# EAGLE schematic OpenDeck-r2.1.0 (EAGLE 7.4.0)
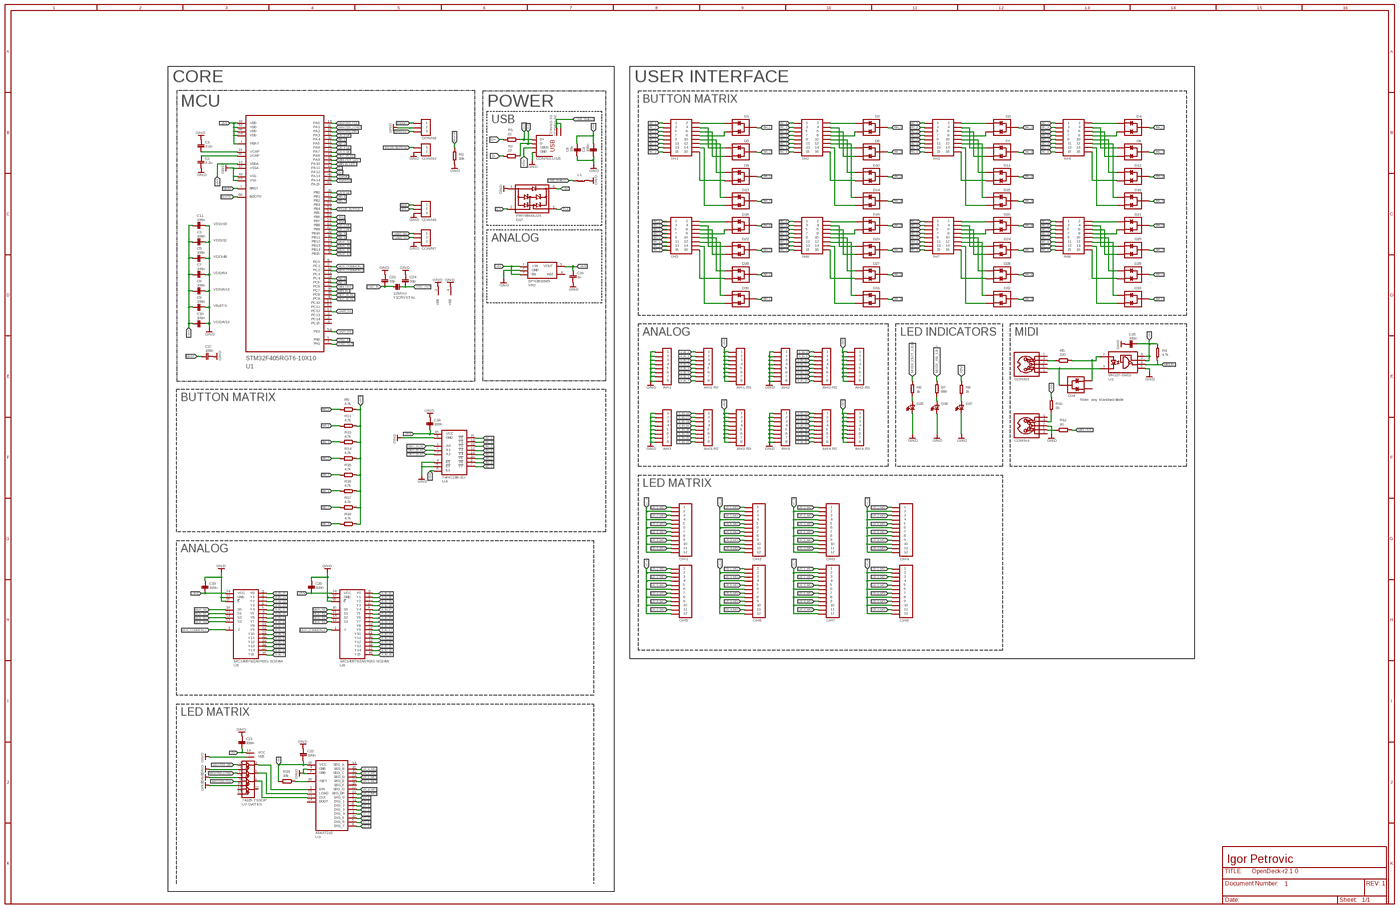
[diagram p0: schematic, sheet 1, overview]
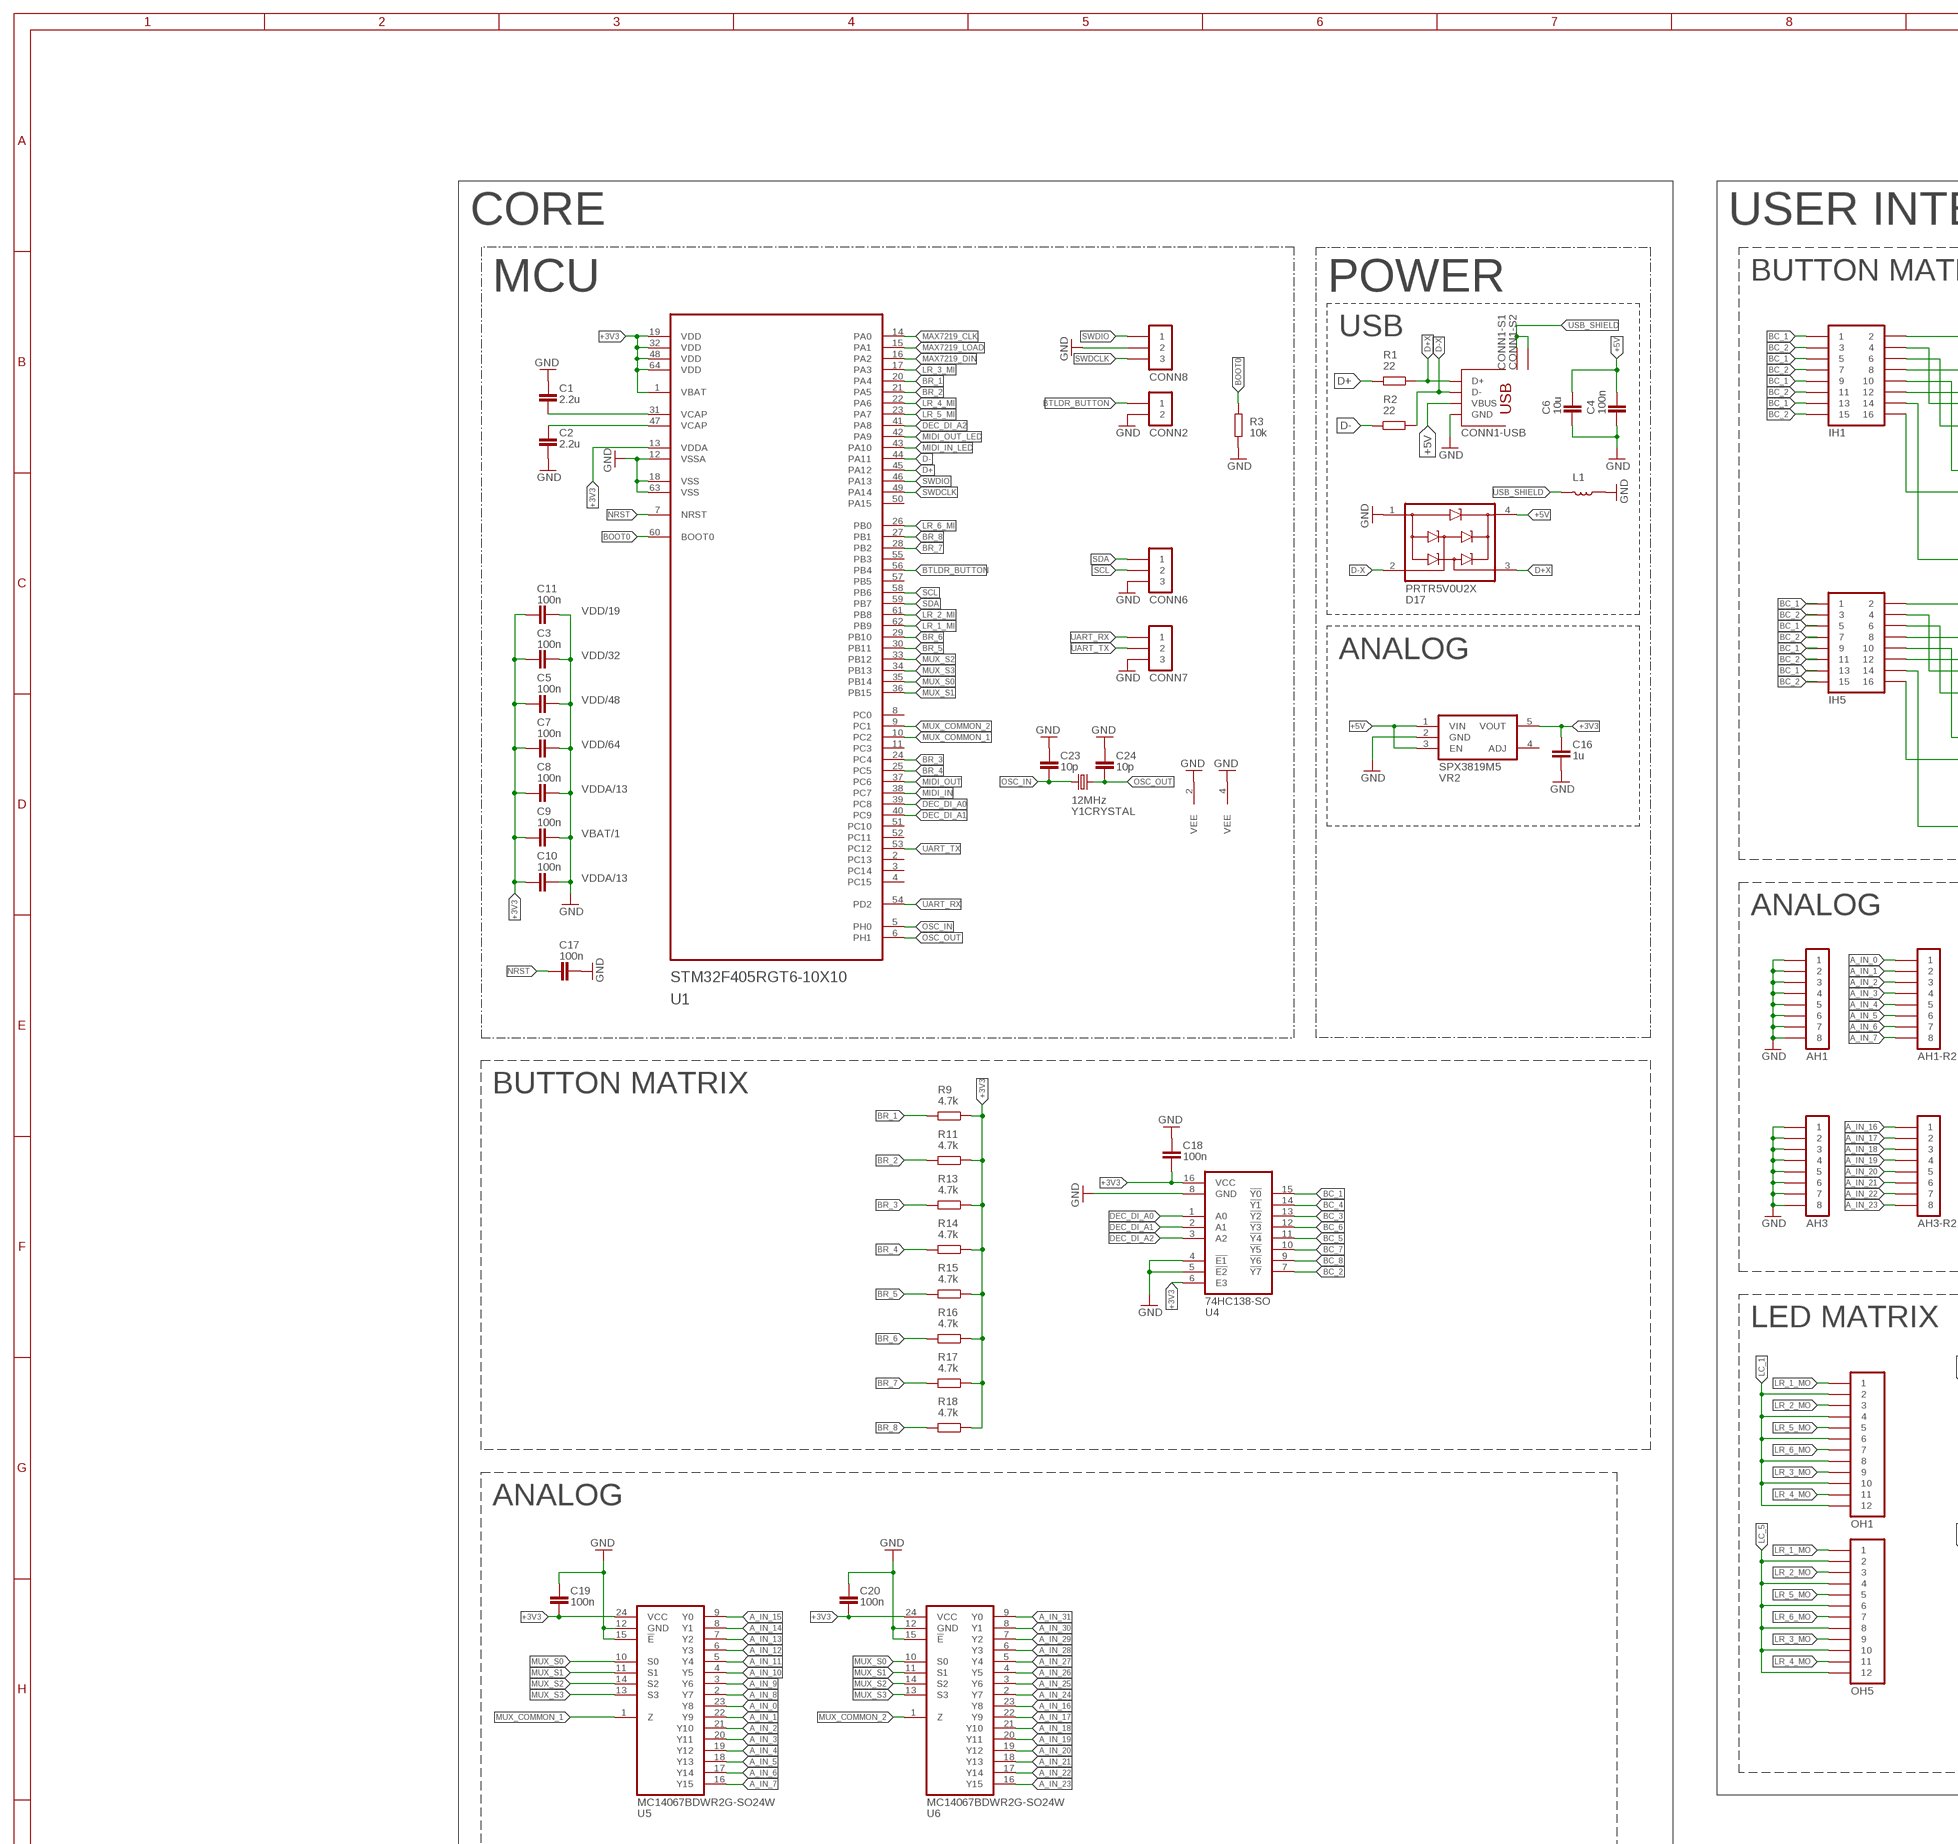
[diagram p1: schematic, sheet 1, part 1 of 4]
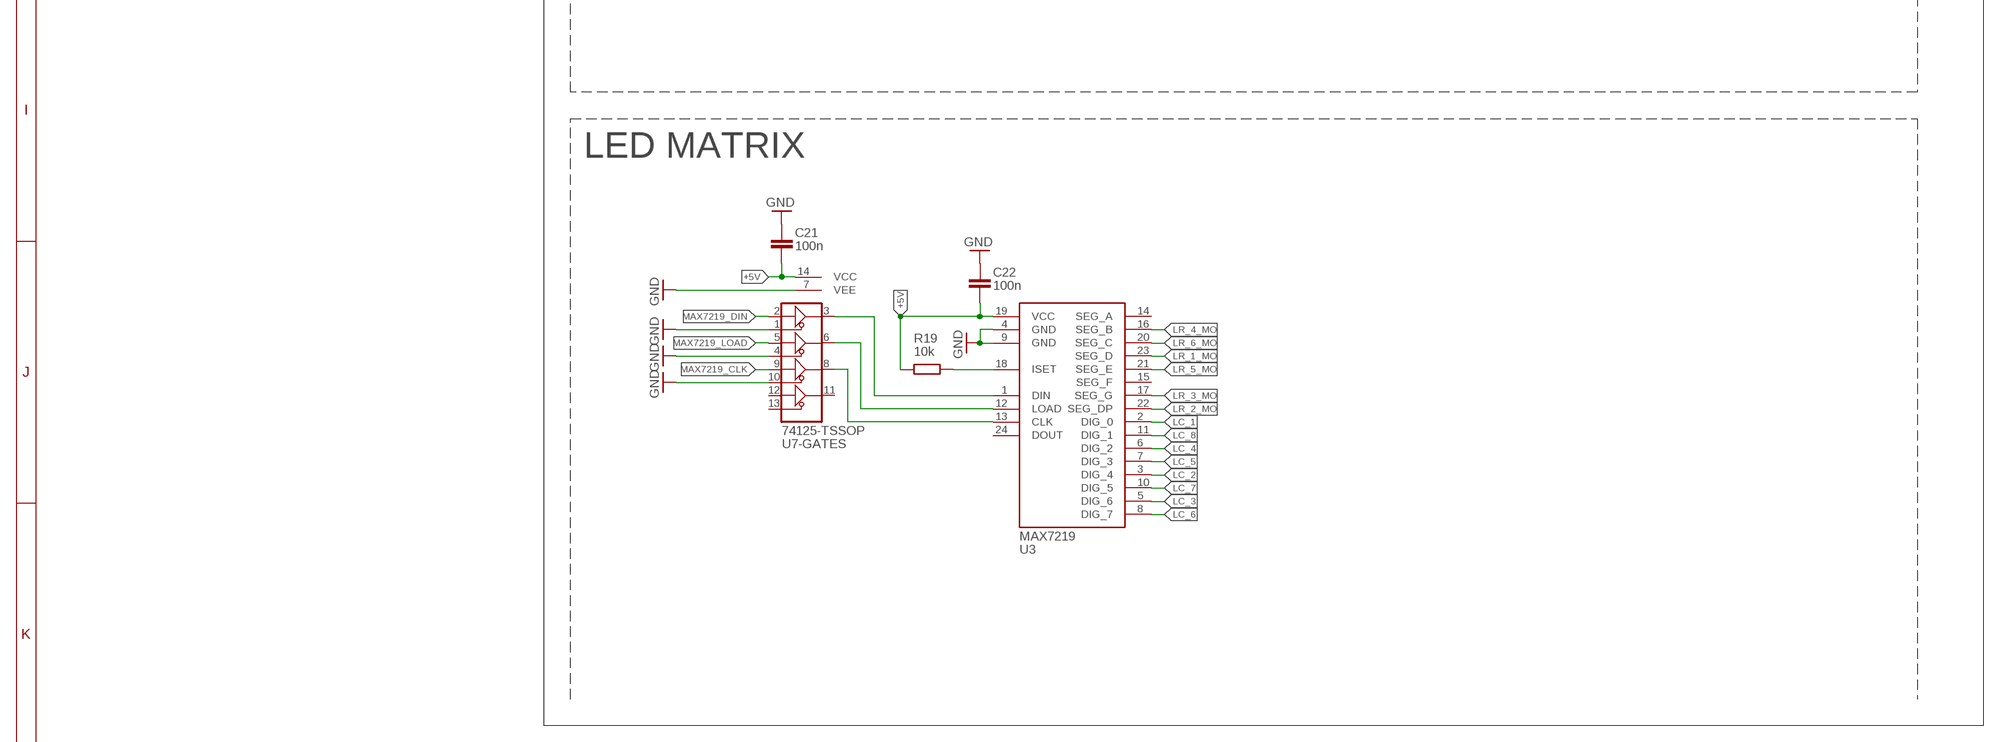
[diagram p2: schematic, sheet 1, part 2 of 4]
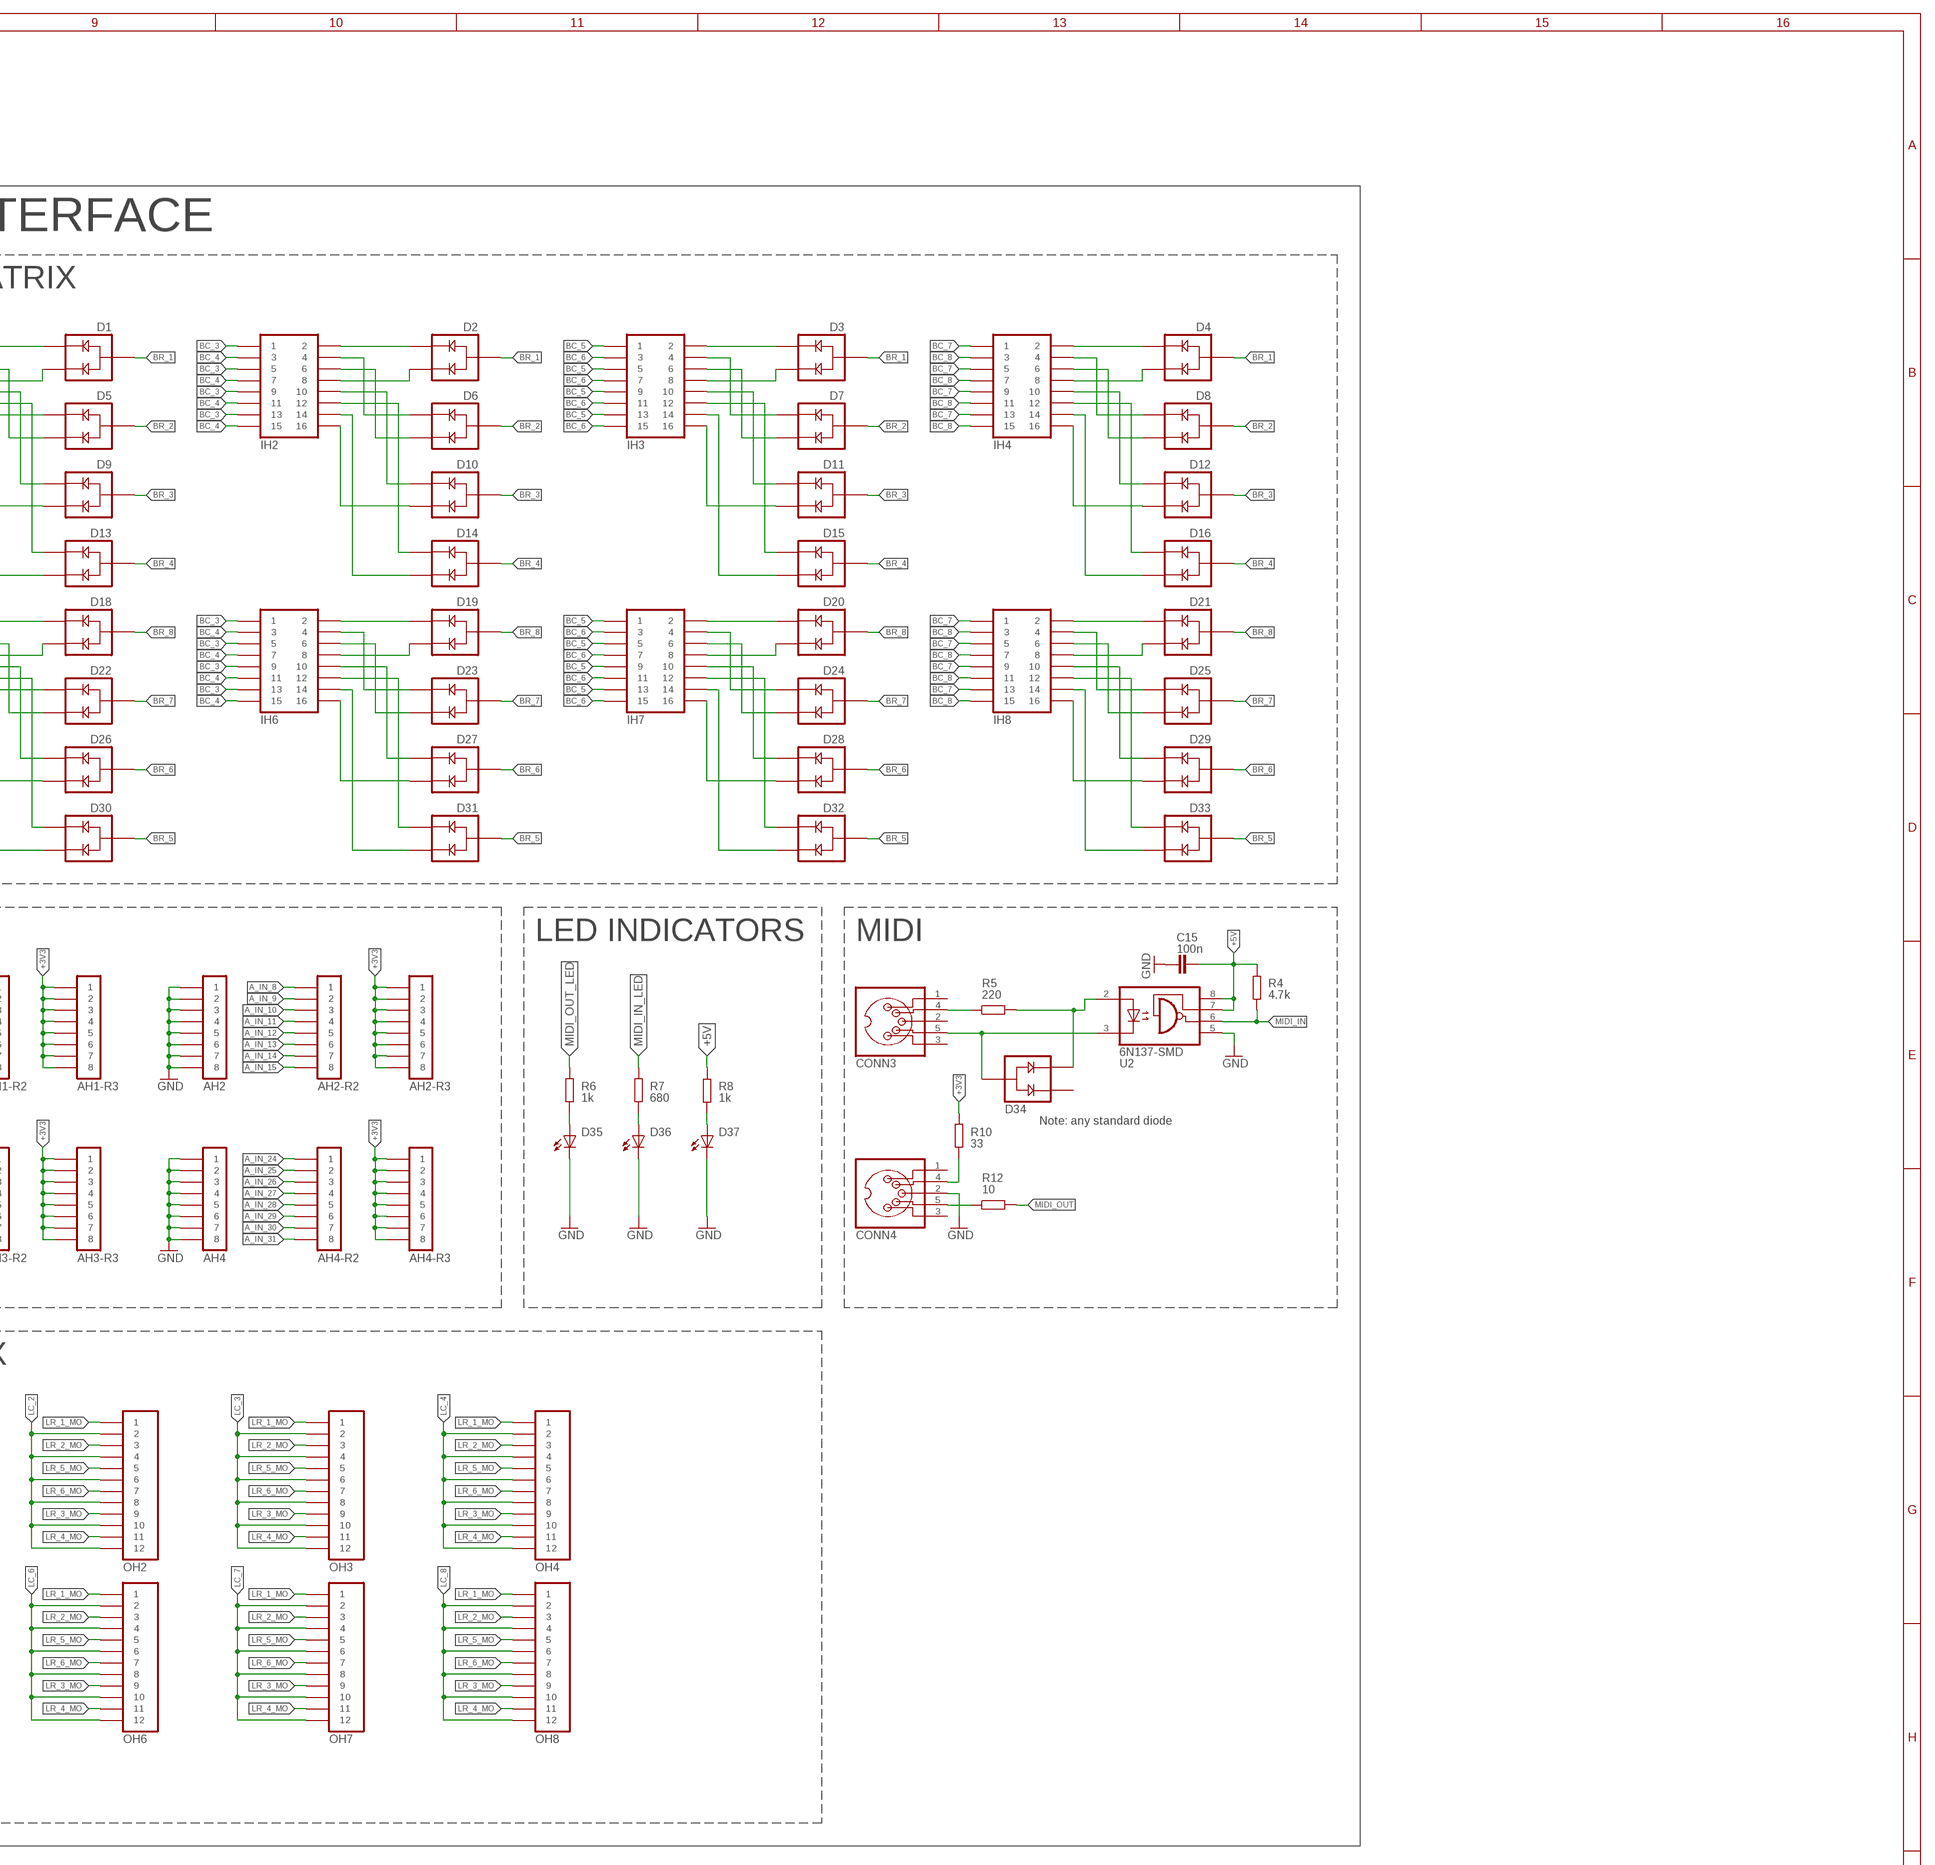
[diagram p3: schematic, sheet 1, part 3 of 4]
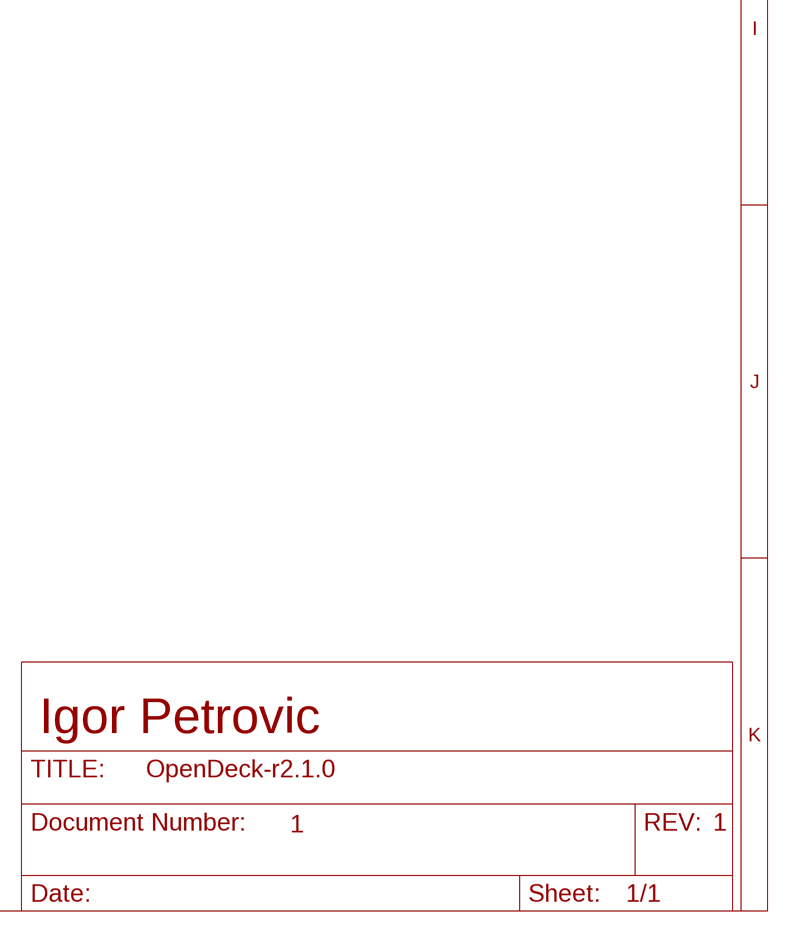
[diagram p4: schematic, sheet 1, part 4 of 4]

## Parts
AH1  PINHD-3X08  [3X08-2.54]
AH2  PINHD-3X08  [3X08-2.54]
AH3  PINHD-3X08  [3X08-2.54]
AH4  PINHD-3X08  [3X08-2.54]
C1  2.2u  CAPACITOR-0402  [C0402]
C2  2.2u  CAPACITOR-0402  [C0402]
C3  100n  CAPACITOR-0402  [C0402]
C4  100n  CAPACITOR-0402  [C0402]
C5  100n  CAPACITOR-0402  [C0402]
C6  10u  CAPACITOR-0402  [C0402]
C7  100n  CAPACITOR-0402  [C0402]
C8  100n  CAPACITOR-0402  [C0402]
C9  100n  CAPACITOR-0402  [C0402]
C10  100n  CAPACITOR-0402  [C0402]
C11  100n  CAPACITOR-0402  [C0402]
C15  100n  CAPACITOR-0402  [C0402]
C16  1u  CAPACITOR-0402  [C0402]
C17  100n  CAPACITOR-0402  [C0402]
C18  100n  CAPACITOR-0402  [C0402]
C19  100n  CAPACITOR-0402  [C0402]
C20  100n  CAPACITOR-0402  [C0402]
C21  100n  CAPACITOR-0402  [C0402]
C22  100n  CAPACITOR-0402  [C0402]
C23  10p  CAPACITOR-0402  [C0402]
C24  10p  CAPACITOR-0402  [C0402]
CONN1  USB-B-H  [USB-B-PTH]
CONN2  PINHD-1X02-TH-2.54MM  [1X02-2.54-V]
CONN3  MIDI_CONN-STD  [DIN5]
CONN4  MIDI_CONN-STD  [DIN5]
CONN6  PINHD-1X03-TH-2.54MM  [1X03-2.54-V]
CONN7  PINHD-1X03-TH-2.54MM  [1X03-2.54-V]
CONN8  PINHD-1X03-TH-2.54MM  [1X03-2.54-V]
D1  BAW56  [SOT23]
D2  BAW56  [SOT23]
D3  BAW56  [SOT23]
D4  BAW56  [SOT23]
D5  BAW56  [SOT23]
D6  BAW56  [SOT23]
D7  BAW56  [SOT23]
D8  BAW56  [SOT23]
D9  BAW56  [SOT23]
D10  BAW56  [SOT23]
D11  BAW56  [SOT23]
D12  BAW56  [SOT23]
D13  BAW56  [SOT23]
D14  BAW56  [SOT23]
D15  BAW56  [SOT23]
D16  BAW56  [SOT23]
D17  PRTR5V0U2X  [SOT143]
D18  BAW56  [SOT23]
D19  BAW56  [SOT23]
D20  BAW56  [SOT23]
D21  BAW56  [SOT23]
D22  BAW56  [SOT23]
D23  BAW56  [SOT23]
D24  BAW56  [SOT23]
D25  BAW56  [SOT23]
D26  BAW56  [SOT23]
D27  BAW56  [SOT23]
D28  BAW56  [SOT23]
D29  BAW56  [SOT23]
D30  BAW56  [SOT23]
D31  BAW56  [SOT23]
D32  BAW56  [SOT23]
D33  BAW56  [SOT23]
D34  BAW56  [SOT23]
D35  Red  LED-0805  [0805_LED]
D36  Yellow  LED-0805  [0805_LED]
D37  Green  LED-0805  [0805_LED]
IH1  PINHD-2X08-TH-2.54MM  [2X08-2.54]
IH2  PINHD-2X08-TH-2.54MM  [2X08-2.54]
IH3  PINHD-2X08-TH-2.54MM  [2X08-2.54]
IH4  PINHD-2X08-TH-2.54MM  [2X08-2.54]
IH5  PINHD-2X08-TH-2.54MM  [2X08-2.54]
IH6  PINHD-2X08-TH-2.54MM  [2X08-2.54]
IH7  PINHD-2X08-TH-2.54MM  [2X08-2.54]
IH8  PINHD-2X08-TH-2.54MM  [2X08-2.54]
L1  FERRITE_BEAD-BLM21PG221SN1D  [L0805]
OH1  PINHD-2X06-TH-2.54MM  [2X06-2.54-V]
OH2  PINHD-2X06-TH-2.54MM  [2X06-2.54-V]
OH3  PINHD-2X06-TH-2.54MM  [2X06-2.54-V]
OH4  PINHD-2X06-TH-2.54MM  [2X06-2.54-V]
OH5  PINHD-2X06-TH-2.54MM  [2X06-2.54-V]
OH6  PINHD-2X06-TH-2.54MM  [2X06-2.54-V]
OH7  PINHD-2X06-TH-2.54MM  [2X06-2.54-V]
OH8  PINHD-2X06-TH-2.54MM  [2X06-2.54-V]
R1  22  RESISTOR-0402  [R0402]
R2  22  RESISTOR-0402  [R0402]
R3  10k  RESISTOR-0402  [R0402]
R4  4.7k  RESISTOR-0402  [R0402]
R5  220  RESISTOR-0402  [R0402]
R6  1k  RESISTOR-0402  [R0402]
R7  680  RESISTOR-0402  [R0402]
R8  1k  RESISTOR-0402  [R0402]
R9  4.7k  RESISTOR-0402  [R0402]
R10  33  RESISTOR-0402  [R0402]
R11  4.7k  RESISTOR-0402  [R0402]
R12  10  RESISTOR-0402  [R0402]
R13  4.7k  RESISTOR-0402  [R0402]
R14  4.7k  RESISTOR-0402  [R0402]
R15  4.7k  RESISTOR-0402  [R0402]
R16  4.7k  RESISTOR-0402  [R0402]
R17  4.7k  RESISTOR-0402  [R0402]
R18  4.7k  RESISTOR-0402  [R0402]
R19  10k  RESISTOR-0402  [R0402]
U1  STM32F405RGT6-10X10  [TQFP-64-10X10]
U2  6N137-SMD  [SMD-8]
U3  MAX7219  [SO24-W]
U4  74HC138-SO  [SO16]
U5  MC14067BDWR2G-SO24W  [SO24-W]
U6  MC14067BDWR2G-SO24W  [SO24-W]
U7  74125-TSSOP  [TSSOP14]
VR2  SPX3819M5  [SOT23-5]
Y1  12MHz  CRYSTAL-4P-SMD-2.5X2  [CRYSTAL-SMD-2.5X2]

## Nets
+3V3: AH1.3 AH1.6 AH1.9 AH1.12 AH1.15 AH1.18 AH1.21 AH1.24 AH2.3 AH2.6 AH2.9 AH2.12 AH2.15 AH2.18 AH2.21 AH2.24 AH3.3 AH3.6 AH3.9 AH3.12 AH3.15 AH3.18 AH3.21 AH3.24 AH4.3 AH4.6 AH4.9 AH4.12 AH4.15 AH4.18 AH4.21 AH4.24 C3.1 C5.1 C7.1 C8.1 C9.1 C10.1 C11.1 C16.1 C18.2 C19.2 C20.2 R9.1 R10.2 R11.1 R13.1 R14.1 R15.1 R16.1 R17.1 R18.1 U1.1(VBAT) U1.13(VDDA) U1.19(VDD) U1.32(VDD) U1.48(VDD) U1.64(VDD) U4.6(E3) U4.16(VCC) U5.24(VCC) U6.24(VCC) VR2.5(VOUT)
+5V [vcc]: C4.2 C6.2 C15.2 C21.1 C22.1 CONN1.VBUS(-USB:VBUS) D17.4(VCC) R4.1 R8.1 R19.2 U2.7(VE) U2.8(VCC) U3.19(VCC) U7.14(-VCC:VCC) VR2.1(VIN) VR2.3(EN)
A_IN_0: AH1.2 U5.23(Y8)
A_IN_1: AH1.5 U5.22(Y9)
A_IN_2: AH1.8 U5.21(Y10)
A_IN_3: AH1.11 U5.20(Y11)
A_IN_4: AH1.14 U5.19(Y12)
A_IN_5: AH1.17 U5.18(Y13)
A_IN_6: AH1.20 U5.17(Y14)
A_IN_7: AH1.23 U5.16(Y15)
A_IN_8: AH2.2 U5.2(Y7)
A_IN_9: AH2.5 U5.3(Y6)
A_IN_10: AH2.8 U5.4(Y5)
A_IN_11: AH2.11 U5.5(Y4)
A_IN_12: AH2.14 U5.6(Y3)
A_IN_13: AH2.17 U5.7(Y2)
A_IN_14: AH2.20 U5.8(Y1)
A_IN_15: AH2.23 U5.9(Y0)
A_IN_16: AH3.2 U6.23(Y8)
A_IN_17: AH3.5 U6.22(Y9)
A_IN_18: AH3.8 U6.21(Y10)
A_IN_19: AH3.11 U6.20(Y11)
A_IN_20: AH3.14 U6.19(Y12)
A_IN_21: AH3.17 U6.18(Y13)
A_IN_22: AH3.20 U6.17(Y14)
A_IN_23: AH3.23 U6.16(Y15)
A_IN_24: AH4.2 U6.2(Y7)
A_IN_25: AH4.5 U6.3(Y6)
A_IN_26: AH4.8 U6.4(Y5)
A_IN_27: AH4.11 U6.5(Y4)
A_IN_28: AH4.14 U6.6(Y3)
A_IN_29: AH4.17 U6.7(Y2)
A_IN_30: AH4.20 U6.8(Y1)
A_IN_31: AH4.23 U6.9(Y0)
BC_1: IH1.1 IH1.5 IH1.9 IH1.13 IH5.1 IH5.5 IH5.9 IH5.13 U4.15(!Y0)
BC_2: IH1.3 IH1.7 IH1.11 IH1.15 IH5.3 IH5.7 IH5.11 IH5.15 U4.7(!Y7)
BC_3: IH2.1 IH2.5 IH2.9 IH2.13 IH6.1 IH6.5 IH6.9 IH6.13 U4.13(!Y2)
BC_4: IH2.3 IH2.7 IH2.11 IH2.15 IH6.3 IH6.7 IH6.11 IH6.15 U4.14(!Y1)
BC_5: IH3.1 IH3.5 IH3.9 IH3.13 IH7.1 IH7.5 IH7.9 IH7.13 U4.11(!Y4)
BC_6: IH3.3 IH3.7 IH3.11 IH3.15 IH7.3 IH7.7 IH7.11 IH7.15 U4.12(!Y3)
BC_7: IH4.1 IH4.5 IH4.9 IH4.13 IH8.1 IH8.5 IH8.9 IH8.13 U4.10(!Y5)
BC_8: IH4.3 IH4.7 IH4.11 IH4.15 IH8.3 IH8.7 IH8.11 IH8.15 U4.9(!Y6)
BOOT0: R3.2 U1.60(BOOT0)
BR_1: D1.3 D2.3 D3.3 D4.3 R9.2 U1.20(PA4)
BR_2: D5.3 D6.3 D7.3 D8.3 R11.2 U1.21(PA5)
BR_3: D9.3 D10.3 D11.3 D12.3 R13.2 U1.24(PC4)
BR_4: D13.3 D14.3 D15.3 D16.3 R14.2 U1.25(PC5)
BR_5: D30.3 D31.3 D32.3 D33.3 R15.2 U1.30(PB11)
BR_6: D26.3 D27.3 D28.3 D29.3 R16.2 U1.29(PB10)
BR_7: D22.3 D23.3 D24.3 D25.3 R17.2 U1.28(PB2)
BR_8: D18.3 D19.3 D20.3 D21.3 R18.2 U1.27(PB1)
BTLDR_BUTTON: CONN2.1 U1.56(PB4)
D+: R1.2 U1.45(PA12)
D+X: CONN1.D+(-USB:D+) D17.3(I/O2) R1.1
D-: R2.1 U1.44(PA11)
D-X: CONN1.D-(-USB:D-) D17.2(I/O1) R2.2
DEC_DI_A0: U1.39(PC8) U4.1(A0)
DEC_DI_A1: U1.40(PC9) U4.2(A1)
DEC_DI_A2: U1.41(PA8) U4.3(A2)
GND: AH1.1 AH1.4 AH1.7 AH1.10 AH1.13 AH1.16 AH1.19 AH1.22 AH2.1 AH2.4 AH2.7 AH2.10 AH2.13 AH2.16 AH2.19 AH2.22 AH3.1 AH3.4 AH3.7 AH3.10 AH3.13 AH3.16 AH3.19 AH3.22 AH4.1 AH4.4 AH4.7 AH4.10 AH4.13 AH4.16 AH4.19 AH4.22 C1.1 C2.2 C3.2 C4.1 C5.2 C6.1 C7.2 C8.2 C9.2 C10.2 C11.2 C15.1 C16.2 C17.2 C18.1 C19.1 C20.1 C21.2 C22.2 C23.2 C24.2 CONN1.GND(-USB:GND) CONN2.2 CONN4.2 CONN6.3 CONN7.3 CONN8.2 D17.1(GND) D35.C D36.C D37.C L1.1 R3.1 U1.12(VSSA) U1.18(VSS) U1.63(VSS) U2.5(GND) U3.4(GND) U3.9(GND) U4.4(!E1) U4.5(!E2) U4.8(GND) U5.12(GND) U5.15(!E) U6.12(GND) U6.15(!E) U7.1(-GATES:1!(OE)) U7.4(-GATES:2!(OE)) U7.7(-GND:VEE) U7.10(-GATES:3!(OE)) VR2.2(GND) Y1.2(GND1:VEE) Y1.4(GND2:VEE)
IH1_2: D1.1 IH1.2
IH1_4: D5.1 IH1.4
IH1_6: D5.2 IH1.6
IH1_8: D1.2 IH1.8
IH1_10: D9.1 IH1.10
IH1_12: D13.1 IH1.12
IH1_14: D13.2 IH1.14
IH1_16: D9.2 IH1.16
IH2_2: D2.1 IH2.2
IH2_4: D6.1 IH2.4
IH2_6: D6.2 IH2.6
IH2_8: D2.2 IH2.8
IH2_10: D10.1 IH2.10
IH2_12: D14.1 IH2.12
IH2_14: D14.2 IH2.14
IH2_16: D10.2 IH2.16
IH3_2: D3.1 IH3.2
IH3_4: D7.1 IH3.4
IH3_6: D7.2 IH3.6
IH3_8: D3.2 IH3.8
IH3_10: D11.1 IH3.10
IH3_12: D15.1 IH3.12
IH3_14: D15.2 IH3.14
IH3_16: D11.2 IH3.16
IH4_2: D4.1 IH4.2
IH4_4: D8.1 IH4.4
IH4_6: D8.2 IH4.6
IH4_8: D4.2 IH4.8
IH4_10: D12.1 IH4.10
IH4_12: D16.1 IH4.12
IH4_14: D16.2 IH4.14
IH4_16: D12.2 IH4.16
IH5_2: D18.1 IH5.2
IH5_4: D22.1 IH5.4
IH5_6: D22.2 IH5.6
IH5_8: D18.2 IH5.8
IH5_10: D26.1 IH5.10
IH5_12: D30.1 IH5.12
IH5_14: D30.2 IH5.14
IH5_16: D26.2 IH5.16
IH6_2: D19.1 IH6.2
IH6_4: D23.1 IH6.4
IH6_6: D23.2 IH6.6
IH6_8: D19.2 IH6.8
IH6_10: D27.1 IH6.10
IH6_12: D31.1 IH6.12
IH6_14: D31.2 IH6.14
IH6_16: D27.2 IH6.16
IH7_2: D20.1 IH7.2
IH7_4: D24.1 IH7.4
IH7_6: D24.2 IH7.6
IH7_8: D20.2 IH7.8
IH7_10: D28.1 IH7.10
IH7_12: D32.1 IH7.12
IH7_14: D32.2 IH7.14
IH7_16: D28.2 IH7.16
IH8_2: D21.1 IH8.2
IH8_4: D25.1 IH8.4
IH8_6: D25.2 IH8.6
IH8_8: D21.2 IH8.8
IH8_10: D29.1 IH8.10
IH8_12: D33.1 IH8.12
IH8_14: D33.2 IH8.14
IH8_16: D29.2 IH8.16
LC_1: OH1.2 OH1.4 OH1.6 OH1.8 OH1.10 OH1.12 U3.2(DIG_0)
LC_2: OH2.2 OH2.4 OH2.6 OH2.8 OH2.10 OH2.12 U3.3(DIG_4)
LC_3: OH3.2 OH3.4 OH3.6 OH3.8 OH3.10 OH3.12 U3.5(DIG_6)
LC_4: OH4.2 OH4.4 OH4.6 OH4.8 OH4.10 OH4.12 U3.6(DIG_2)
LC_5: OH5.2 OH5.4 OH5.6 OH5.8 OH5.10 OH5.12 U3.7(DIG_3)
LC_6: OH6.2 OH6.4 OH6.6 OH6.8 OH6.10 OH6.12 U3.8(DIG_7)
LC_7: OH7.2 OH7.4 OH7.6 OH7.8 OH7.10 OH7.12 U3.10(DIG_5)
LC_8: OH8.2 OH8.4 OH8.6 OH8.8 OH8.10 OH8.12 U3.11(DIG_1)
LR_1_MI: U1.62(PB9)
LR_1_MO: OH1.1 OH2.1 OH3.1 OH4.1 OH5.1 OH6.1 OH7.1 OH8.1 U3.23(SEG_D)
LR_2_MI: U1.61(PB8)
LR_2_MO: OH1.3 OH2.3 OH3.3 OH4.3 OH5.3 OH6.3 OH7.3 OH8.3 U3.22(SEG_DP)
LR_3_MI: U1.17(PA3)
LR_3_MO: OH1.9 OH2.9 OH3.9 OH4.9 OH5.9 OH6.9 OH7.9 OH8.9 U3.17(SEG_G)
LR_4_MI: U1.22(PA6)
LR_4_MO: OH1.11 OH2.11 OH3.11 OH4.11 OH5.11 OH6.11 OH7.11 OH8.11 U3.16(SEG_B)
LR_5_MI: U1.23(PA7)
LR_5_MO: OH1.5 OH2.5 OH3.5 OH4.5 OH5.5 OH6.5 OH7.5 OH8.5 U3.21(SEG_E)
LR_6_MI: U1.26(PB0)
LR_6_MO: OH1.7 OH2.7 OH3.7 OH4.7 OH5.7 OH6.7 OH7.7 OH8.7 U3.20(SEG_C)
MAX7219_CLK: U1.14(PA0) U7.9(-GATES:3A)
MAX7219_DIN: U1.16(PA2) U7.2(-GATES:1A)
MAX7219_LOAD: U1.15(PA1) U7.5(-GATES:2A)
MIDI_IN: R4.2 U1.38(PC7) U2.6(VO)
MIDI_IN_4: CONN3.4 R5.1
MIDI_IN_5: CONN3.5 D34.3 U2.3(C)
MIDI_IN_DIODE_OUT: D34.2 R5.2 U2.2(A)
MIDI_IN_LED: R7.2 U1.43(PA10)
MIDI_IN_LED_R: D36.A R7.1
MIDI_OUT: R12.2 U1.37(PC6)
MIDI_OUT_4: CONN4.4 R10.1
MIDI_OUT_5: CONN4.5 R12.1
MIDI_OUT_LED: R6.2 U1.42(PA9)
MIDI_OUT_LED_R: D35.A R6.1
MUX_COMMON_1: U1.10(PC2) U5.1(Z)
MUX_COMMON_2: U1.9(PC1) U6.1(Z)
MUX_S0: U1.35(PB14) U5.10(S0) U6.10(S0)
MUX_S1: U1.36(PB15) U5.11(S1) U6.11(S1)
MUX_S2: U1.33(PB12) U5.14(S2) U6.14(S2)
MUX_S3: U1.34(PB13) U5.13(S3) U6.13(S3)
N$1: C1.2 U1.31(VCAP)
N$2: C2.1 U1.47(VCAP)
N$4: U3.1(DIN) U7.3(-GATES:1Y)
N$5: U3.12(LOAD) U7.6(-GATES:2Y)
N$6: U3.13(CLK) U7.8(-GATES:3Y)
N$7: R19.1 U3.18(ISET)
NRST: C17.1 U1.7(NRST)
OSC_IN: C23.1 U1.5(PH0) Y1.1
OSC_OUT: C24.1 U1.6(PH1) Y1.3
PWR_LED_R: D37.A R8.2
SCL: CONN6.2 U1.58(PB6)
SDA: CONN6.1 U1.59(PB7)
SWDCLK: CONN8.3 U1.49(PA14)
SWDIO: CONN8.1 U1.46(PA13)
UART_RX: CONN7.1 U1.54(PD2)
UART_TX: CONN7.2 U1.53(PC12)
USB_SHIELD: CONN1.S1(-S1:S) CONN1.S2(-S2:S) L1.2
Unconnected: CONN3.1 CONN3.2 CONN3.3 CONN4.1 CONN4.3 D34.1 U1.2(PC13) U1.3(PC14) U1.4(PC15) U1.8(PC0) U1.11(PC3) U1.50(PA15) U1.51(PC10) U1.52(PC11) U1.55(PB3) U1.57(PB5) U3.14(SEG_A) U3.15(SEG_F) U3.24(DOUT) U7.11(-GATES:4Y) U7.12(-GATES:4A) U7.13(-GATES:4!(OE)) VR2.4(ADJ)

## Notes on the sheet
- CORE | USER INTERFACE
- BUTTON MATRIX
- MCU | POWER
- USB
- VDD/19
- VDD/32 | ANALOG
- VDD/48
- VDD/64
- VDDA/13
- VBAT/1
- VDDA/13
- ANALOG | LED INDICATORS | MIDI
- BUTTON MATRIX | Note: any standard diode
- LED MATRIX
- ANALOG
- LED MATRIX
- Igor Petrovic
- 1 | 1

## Library data of the parts
AH1-AH4 = igor_lbr:PINHD-3X08: Pin header
C1 C2 = igor_lbr:CAPACITOR: Capacitor; LCSC: C12530
C3-C5 C7-C11 C15 C17-C22 = igor_lbr:CAPACITOR: Capacitor; LCSC: C1525
C6 = igor_lbr:CAPACITOR: Capacitor; LCSC: C15525
C16 = igor_lbr:CAPACITOR: Capacitor; LCSC: C52923
C23 C24 = igor_lbr:CAPACITOR: Capacitor; LCSC: C32949
CONN1 = igor_lbr:USB: USB B connector, horizontal; LCSC: C114097
CONN2 = igor_lbr:PINHD-1X02: Pin Header
CONN3 CONN4 = igor_lbr:MIDI_CONN: DIN MIDI connector; MANUFACTURER: Switchcraft; MPN: 57PC5F
CONN6-CONN8 = igor_lbr:PINHD-1X03: Pin Header
D1-D16 D18-D34 = igor_lbr:BAW56: Small Signal Diode; LCSC: C8663; MANUFACTURER: Multicomp; MPN: BAW56-7-F
D17 = igor_lbr:PRTR5V0U2X: Ultra low capacitance double rail-to-rail ESD protection diode; LCSC: C2827688; MANUFACTURER: Nexperia; MPN: PRTR5V0U2X
D35 D37 = igor_lbr:LED: LED; LCSC: C84256
D36 = igor_lbr:LED: LED; LCSC: C142303
IH1-IH8 = igor_lbr:PINHD-2X08
L1 = igor_lbr:FERRITE_BEAD: Ferrite Bead; LCSC: C85840; MANUFACTURER: Murata; MPN: BLM21PG221SN1D
OH1-OH8 = igor_lbr:PINHD-2X06: Pin Header
R1 R2 = igor_lbr:RESISTOR: Resistor; LCSC: C25092
R3 R19 = igor_lbr:RESISTOR: Resistor; LCSC: C25744
R4 R9 R11 R13-R18 = igor_lbr:RESISTOR: Resistor; LCSC: C25900
R5 = igor_lbr:RESISTOR: Resistor; LCSC: C25091
R6 R8 = igor_lbr:RESISTOR: Resistor; LCSC: C11702
R7 = igor_lbr:RESISTOR: Resistor; LCSC: C25130
R10 = igor_lbr:RESISTOR: Resistor; LCSC: C25105
R12 = igor_lbr:RESISTOR: Resistor; LCSC: C25077
U1 = igor_lbr:STM32F405RGT6: ARM Cortex-M4 32b MCU+FPU; LCSC: C15742; MANUFACTURER: ST Microelectronics; MPN: STM32F405RGT6
U2 = igor_lbr:6N137: High Speed Optocoupler; LCSC: C92651; MANUFACTURER: Lite-On; MPN: 6N137S
U3 = igor_lbr:MAX7219: Serially Interfaced, 8-Digit LED Display Drivers; LCSC: C9964
U4 = igor_lbr:74*138: 3-to-8 line decoder/demultiplexer; inverting; LCSC: C6818; MANUFACTURER: Nexperia; MPN: 74HC138D
U5 U6 = igor_lbr:MC14067BDWR2G: 16-Channel Analog Multiplexer/Demultiplexer; LCSC: C496123; MANUFACTURER: ON Semiconductor; MPN: MC14067BDWR2G
U7 = igor_lbr:74*125: Quad buffer/line driver; LCSC: C36365
VR2 = igor_lbr:SPX3819M5: 500mA Low-Noise LDO Voltage Regulator; LCSC: C9055
Y1 = igor_lbr:CRYSTAL-4P: Crystal; LCSC: C254284; MANUFACTURER: ECS; MPN: ECS-160-10-36-CKM-TR

## Net classes
0 default: width 0.203 mm
1 vcc: width 0.254 mm